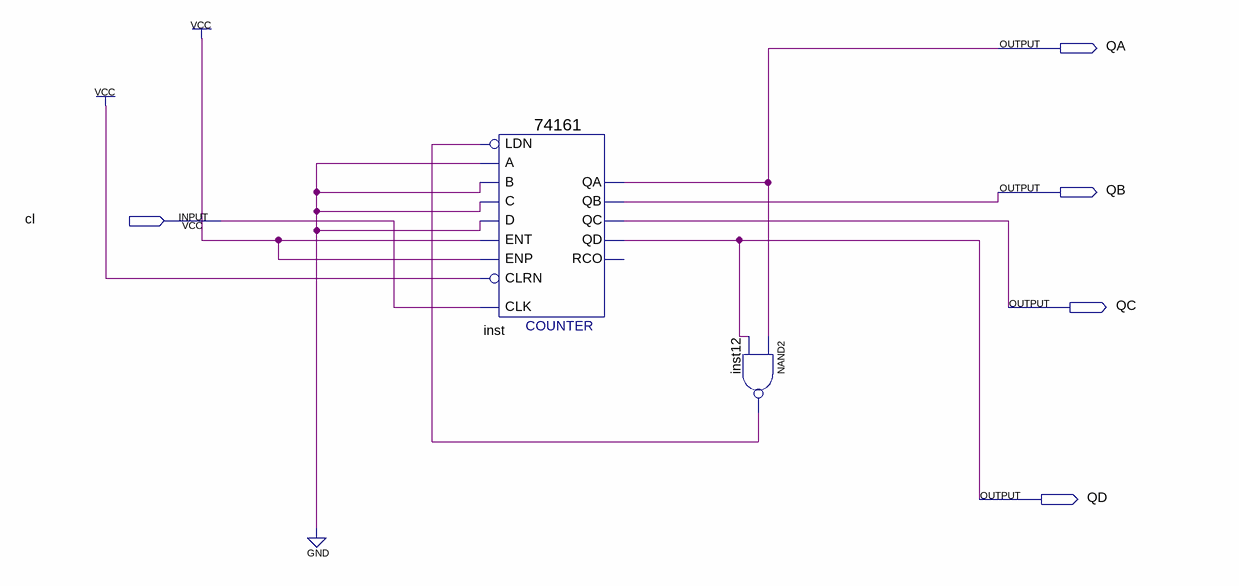
[diagram p0: schematic sheet]
// Quartus schematic ex.bdf as structural Verilog: 2 symbols, 5 pins
module ex (
  input  cl,
  output QA,
  output QB,
  output QC,
  output QD
);

  wire inst12_out;

  \74161  inst (
    .CLRN(1'b1), .CLK(cl), .ENP(1'b1), .LDN(inst12_out), .A(1'b0), .D(1'b0), .ENT(1'b1), .B(1'b0), .C(1'b0),
    .QD(QD), .QC(QC), .QB(QB), .QA(QA));  // open: RCO
  nand inst12 (inst12_out, QA, QD);
endmodule
